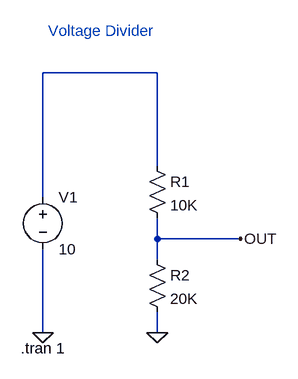
[diagram p0: schematic voltage_divider.asc]
voltage_divider.asc, the LTspice schematic file:
Version 4
SHEET 1 880 680
WIRE 256 -80 80 -80
WIRE 256 64 256 -80
WIRE 80 112 80 -80
WIRE 256 176 256 144
WIRE 384 176 256 176
WIRE 256 208 256 176
WIRE 80 320 80 192
WIRE 256 320 256 288
FLAG 80 320 0
FLAG 256 320 0
FLAG 384 176 OUT
SYMBOL res 240 48 R0
SYMATTR InstName R1
SYMATTR Value 10K
SYMBOL res 240 192 R0
SYMATTR InstName R2
SYMATTR Value 20K
SYMBOL voltage 80 96 R0
WINDOW 123 0 0 Left 0
WINDOW 39 0 0 Left 0
SYMATTR InstName V1
SYMATTR Value 10
TEXT 46 344 Left 2 !.tran 1
TEXT 88 -144 Left 2 ;Voltage Divider

The netlist it stands for:
* voltage_divider.asc
R1 N001 OUT 10K
R2 OUT 0 20K
V1 N001 0 10
.tran 1
* Voltage Divider
.backanno
.end